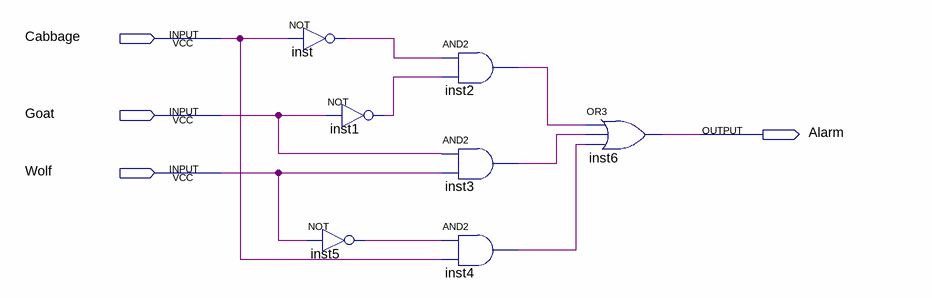
[diagram p0: schematic sheet]
// Quartus schematic lab3step0.bdf as structural Verilog: 7 symbols, 4 pins
module lab3step0 (
  input  Cabbage,
  input  Goat,
  input  Wolf,
  output Alarm
);

  wire inst1_out, inst2_out, inst3_out, inst4_out, inst5_out, inst_out;

  not inst (inst_out, Cabbage);
  not inst1 (inst1_out, Goat);
  not inst5 (inst5_out, Wolf);
  and inst2 (inst2_out, inst_out, inst1_out);
  and inst3 (inst3_out, Goat, Wolf);
  and inst4 (inst4_out, inst5_out, Cabbage);
  or inst6 (Alarm, inst2_out, inst3_out, inst4_out);
endmodule
